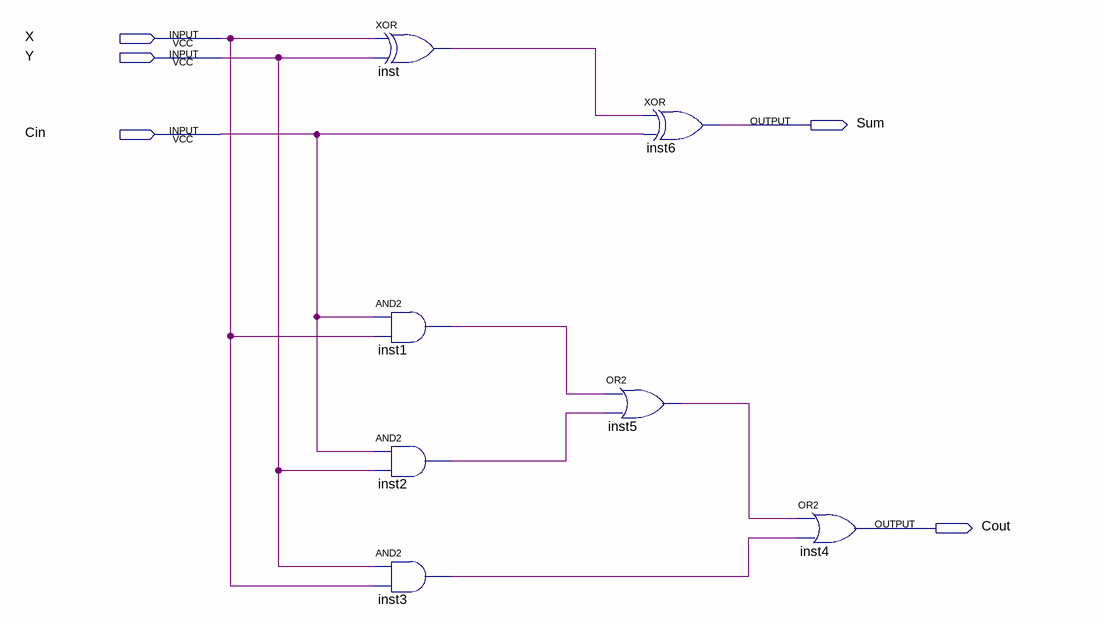
[diagram p0: schematic sheet]
// Quartus schematic FA.bdf as structural Verilog: 7 symbols, 5 pins
module FA (
  input  X,
  input  Y,
  input  Cin,
  output Sum,
  output Cout
);

  wire inst1_out, inst2_out, inst3_out, inst5_out, inst_out;

  xor inst (inst_out, X, Y);
  and inst1 (inst1_out, Cin, X);
  and inst2 (inst2_out, Cin, Y);
  and inst3 (inst3_out, Y, X);
  or inst5 (inst5_out, inst1_out, inst2_out);
  xor inst6 (Sum, inst_out, Cin);
  or inst4 (Cout, inst5_out, inst3_out);
endmodule
